# EAGLE design MateLightScrewCap (EAGLE 9.5.1)
DATE: 31.10.2019; EDITOR: Hans Achterbahn; LICENSE: MIT License; PROJECT: MateLightScrewCap-PCB; VERSION: v0.1.0
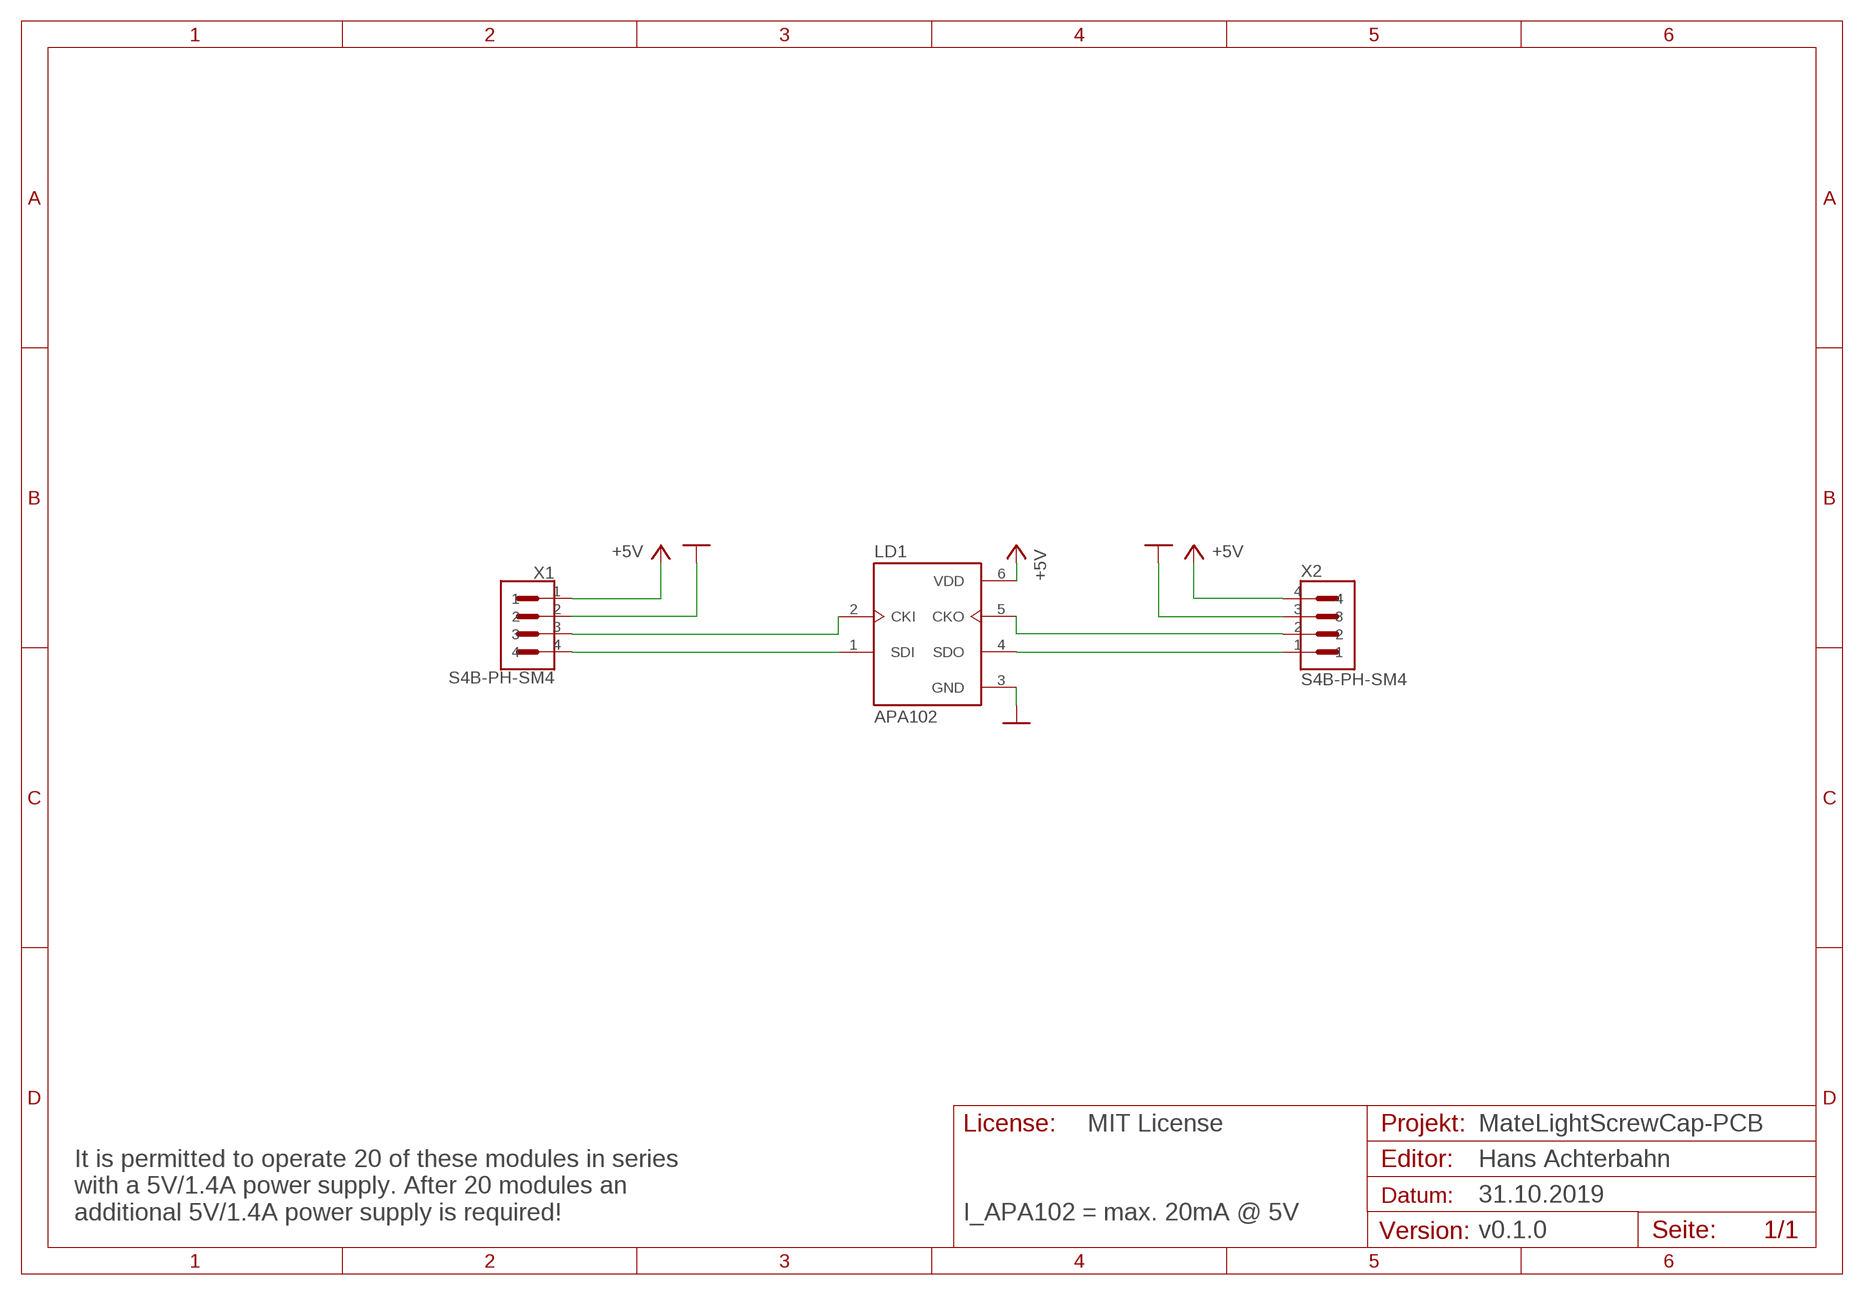
[diagram p0: schematic, sheet 1]

## Parts
LD1  APA102  APA102APA102C-5050  [APA102C-5050]
X1  S4B-PH-SM4  S4B-PH-SM4-TB  [JST_S4B-PH-SM4-TB]
X2  S4B-PH-SM4  S4B-PH-SM4-TB  [JST_S4B-PH-SM4-TB]

## Nets
+5V: LD1.6(VDD) X1.1 X2.4
GND: LD1.3(GND) X1.2 X2.3
LED-SPI-CLK-IN: LD1.2(CKI) X1.3
LED-SPI-CLK-OUT: LD1.5(CKO) X2.2
LED-SPI-MOSI-IN: LD1.1(SDI) X1.4
LED-SPI-MOSI-OUT: LD1.4(SDO) X2.1

## Notes on the sheet
- License:
- It is permitted to operate 20 of these modules in series 
  with a 5V/1.4A power supply. After 20 modules an
  additional 5V/1.4A power supply is required!
- I_APA102 = max. 20mA @ 5V

## Library data of the parts
LD1 = h8-optic:APA102: DotStar Micro LEDs (APA102–2020)- Smart SMD RGB LED - 100 pack
X1 X2 = h8-connector:S4B-PH-SM4-TB: JST - S4B-PH-SM4-TB Hersteller: JST Grid: 2.00 mm Montage: SMD Nennstrom: 2A (AWG#24) Nennspannung 100 V Homepage: https://order.jst-mfg.com/InternetShop/app/index.php?back=2&product=57531300&jgcd=0#showProductDetail Datenblatt: http://www.jst-mfg.com/product/pdf/eng/ePH.pdf?5dbadb1b33e6d Created by SnapEDA (S4B-PH-SM4-T <https://www.snapeda.com/parts/S4B-PH-SM4-TB/JST%20Sales/view-part/?ref=search&t=S4B-PH-SM4-T>) Edited by Hans Achterbahn (https://github.com/HansAchterbahn); DESCRIPTION: Socket; wire-board; male; PIN: 4; 2mm; SMT; PH; 100V; 2A; -25÷85°C; DIGI-KEY: 455-1751-2-ND; MF: JST Sales; MFN: S4B-PH-SM4-TB; MOUSER: -; RS-ONLINE: 688-1366

## Net classes
0 default: width 0.2 mm, drill 0.2 mm, clearance 0.15 mm
1 Power: width 0.2 mm, drill 0.2 mm, clearance 0.15 mm

## Board
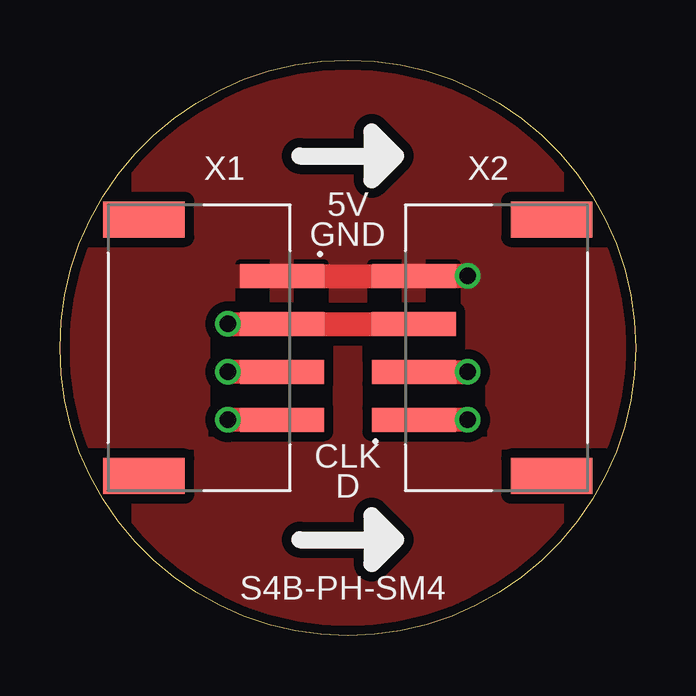
[diagram p1: board, top side]
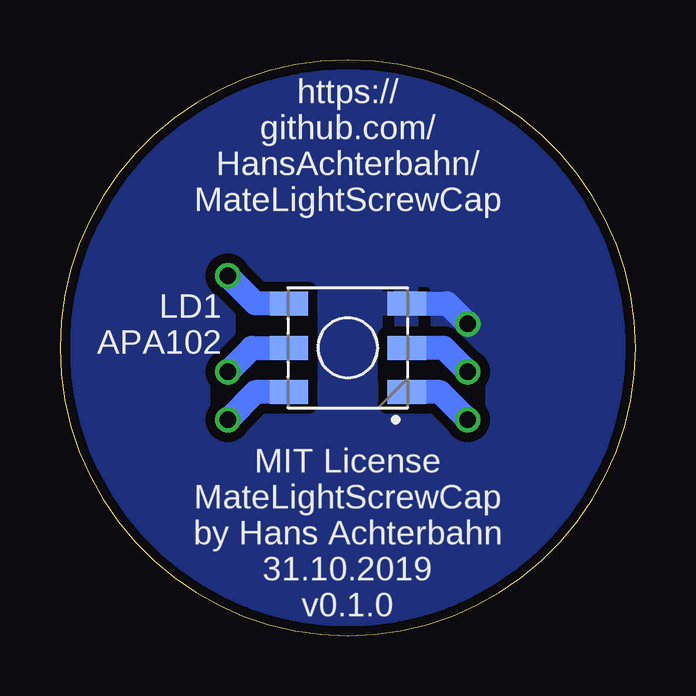
[diagram p2: board, bottom side, seen from below]

Size 24 x 24 mm. Coordinates in mm from the lower left corner, seen from the top.
Outline: 0,12 arc-90 12,24 arc-90 24,12 arc-90 12,0 arc-90 0,12
Copper layers (1*16): Top 0.018mm / dielectric 1.55mm / Bottom 0.018mm
Design rules "Multi-CB_2L_100æm-Tracks_OL35æm": minimum track width 0.1mm, minimum drill 0.2mm, track to track 0.1mm, track to pad 0.1mm, pad to pad 0.1mm, via to via 0.1mm, smd to smd 0mil, copper to edge 0.2mm, drill to drill 0.2mm, minimum pad ring 0.125mm, minimum via ring 0.1mm, stop-mask expansion 2mil, vias tented up to drill 0.45mm, thermal gap 0.2mm

### Footprints (pad centres in the part's own frame; a part is rotated, then mirrored left to right if it is on the bottom)
APA102C-5050 = smd 1.6 x 1: 1 -2.45,1.85; 2 -2.45,0; 3 -2.45,-1.85; 4 2.45,1.85; 5 2.45,0; 6 2.45,-1.85
JST_S4B-PH-SM4-TB = smd 1 x 3.5: 1 3,-7.25; 2 1,-7.25; 3 -1,-7.25; 4 -3,-7.25 | smd 1.5 x 3.4: P1 5.35,-1.5; P2 -5.35,-1.5

### Placement (x,y rotation side)
LD1  12,12 180 bottom
X1  S4B-PH-SM4-TB  [JST_S4B-PH-SM4-TB]  2,12 90 top
X2  22,12 270 top

### Tracks (layer width: path | path; a pad name or v marks a point on that pad's centre or on a via)
+5V  (via drill 0.7)
  Top 1: X1.1 X2.4 v17,15
  Bottom 1: LD1.6 15.85,13.85 v17,15
  pour Top (isolate 0.4): 24,12 arc-90 12,0 arc-90 0,12 arc-90 12,24 arc-90
GND  (via drill 0.7)
  Top 1: X2.3 X1.2 v7,13
  Bottom 1: LD1.3 7.85,13.85 v7,13
  pour Bottom (isolate 0.4): 0,12 arc-90 12,24 arc-90 24,12 arc-90 12,0 arc-90
LED-SPI-CLK-IN  (via drill 0.7)
  Top 1: X1.3 v7,11
  Bottom 1: v7,11 8,12 LD1.2
LED-SPI-CLK-OUT  (via drill 0.7)
  Top 1: X2.2 v17,11
  Bottom 1: v17,11 16,12 LD1.5
LED-SPI-MOSI-IN  (via drill 0.7)
  Top 1: X1.4 v7,9
  Bottom 1: v7,9 8.15,10.15 LD1.1
LED-SPI-MOSI-OUT  (via drill 0.7)
  Top 1: v17,9 X2.1
  Bottom 1: LD1.4 15.85,10.15 v17,9
N$1
  Top 0.7: 10,20 14,20 | 14,20 13,21 13,19 14,20
N$2
  Top 0.7: 10,4 14,4 | 14,4 13,5 13,3 14,4

### Text on the board
tPlace: 5V | GND | CLK | D
bNames: https:// / github.com/ / HansAchterbahn/ / MateLightScrewCap | MIT License / MateLightScrewCap / by Hans Achterbahn / 31.10.2019 / v0.1.0